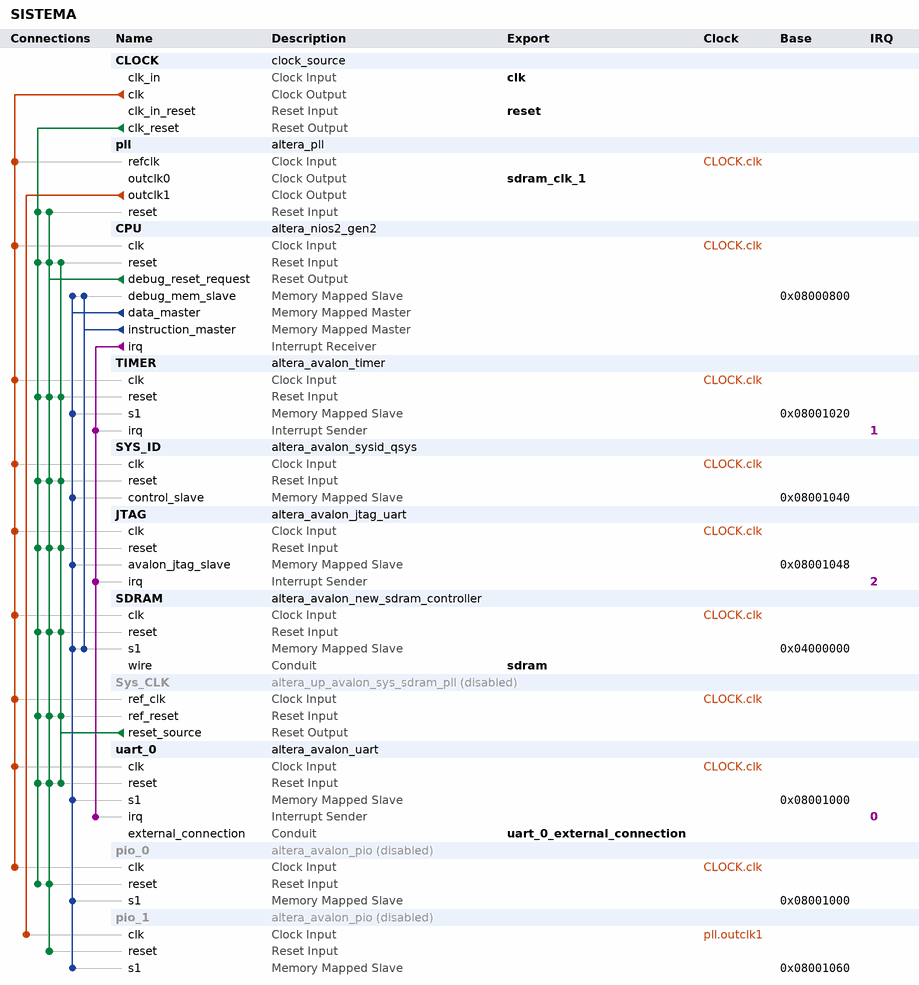
[diagram p0: system contents]
# Platform Designer (Qsys) system SISTEMA, Cyclone V 5CSXFC6D6F31C6
# Parameters at their usual value, and those the tool derives, are not listed.
package require -exact qsys 17.0
create_system SISTEMA
set_project_property DEVICE_FAMILY {Cyclone V}
set_project_property DEVICE 5CSXFC6D6F31C6

add_instance CLOCK clock_source 17.0
set_instance_parameter_value CLOCK clockFrequency 50000000

add_instance pll altera_pll 17.0
set_instance_parameter_value pll gui_device_speed_grade 1
set_instance_parameter_value pll gui_number_of_clocks 2
set_instance_parameter_value pll gui_operation_mode direct
set_instance_parameter_value pll gui_output_clock_frequency0 50.0
set_instance_parameter_value pll gui_output_clock_frequency1 50.0
set_instance_parameter_value pll gui_phase_shift0 -3800
set_instance_parameter_value pll gui_pll_mode {Integer-N PLL}
set_instance_parameter_value pll gui_reference_clock_frequency 50.0
set_instance_parameter_value pll gui_use_locked false

add_instance CPU altera_nios2_gen2 17.0
set_instance_parameter_value CPU dcache_size 2048
set_instance_parameter_value CPU exceptionSlave SDRAM.s1
set_instance_parameter_value CPU icache_size 4096
set_instance_parameter_value CPU impl Tiny
set_instance_parameter_value CPU resetSlave SDRAM.s1

add_instance TIMER altera_avalon_timer 17.0
set_instance_parameter_value TIMER period 1
set_instance_parameter_value TIMER periodUnits MSEC

add_instance SYS_ID altera_avalon_sysid_qsys 17.0
set_instance_parameter_value SYS_ID id 0

add_instance JTAG altera_avalon_jtag_uart 17.0
set_instance_parameter_value JTAG simInteractiveOptions NO_INTERACTIVE_WINDOWS

add_instance SDRAM altera_avalon_new_sdram_controller 17.0
set_instance_parameter_value SDRAM TAC 5.5
set_instance_parameter_value SDRAM TRCD 20.0
set_instance_parameter_value SDRAM TRP 20.0
set_instance_parameter_value SDRAM casLatency 3
set_instance_parameter_value SDRAM columnWidth 10
set_instance_parameter_value SDRAM dataWidth 16
set_instance_parameter_value SDRAM generateSimulationModel false
set_instance_parameter_value SDRAM model single_Micron_MT48LC4M32B2_7_chip
set_instance_parameter_value SDRAM numberOfBanks 4
set_instance_parameter_value SDRAM numberOfChipSelects 1
set_instance_parameter_value SDRAM powerUpDelay 200.0
set_instance_parameter_value SDRAM refreshPeriod 7.8125
set_instance_parameter_value SDRAM rowWidth 13

add_instance Sys_CLK altera_up_avalon_sys_sdram_pll 17.0
set_instance_property Sys_CLK ENABLED false
set_instance_parameter_value Sys_CLK CV_boards DE10-Standard
set_instance_parameter_value Sys_CLK gui_outclk 50.0
set_instance_parameter_value Sys_CLK gui_refclk 50.0

add_instance uart_0 altera_avalon_uart 17.0
set_instance_parameter_value uart_0 baud 115200
set_instance_parameter_value uart_0 dataBits 8
set_instance_parameter_value uart_0 fixedBaud true
set_instance_parameter_value uart_0 parity NONE
set_instance_parameter_value uart_0 stopBits 1

add_instance pio_0 altera_avalon_pio 17.0
set_instance_property pio_0 ENABLED false
set_instance_parameter_value pio_0 bitModifyingOutReg true
set_instance_parameter_value pio_0 direction Output
set_instance_parameter_value pio_0 width 7

add_instance pio_1 altera_avalon_pio 17.0
set_instance_property pio_1 ENABLED false
set_instance_parameter_value pio_1 direction Output
set_instance_parameter_value pio_1 width 14

# connections
add_connection CLOCK.clk CPU.clk clock
add_connection CLOCK.clk JTAG.clk clock
add_connection CLOCK.clk pio_0.clk clock
add_connection CLOCK.clk pll.refclk clock
add_connection CLOCK.clk SDRAM.clk clock
add_connection CLOCK.clk Sys_CLK.ref_clk clock
add_connection CLOCK.clk SYS_ID.clk clock
add_connection CLOCK.clk TIMER.clk clock
add_connection CLOCK.clk uart_0.clk clock
add_connection pll.outclk1 pio_1.clk clock
add_connection CLOCK.clk_reset CPU.reset reset
add_connection CLOCK.clk_reset JTAG.reset reset
add_connection CLOCK.clk_reset pio_0.reset reset
add_connection CLOCK.clk_reset pll.reset reset
add_connection CLOCK.clk_reset SDRAM.reset reset
add_connection CLOCK.clk_reset Sys_CLK.ref_reset reset
add_connection CLOCK.clk_reset SYS_ID.reset reset
add_connection CLOCK.clk_reset TIMER.reset reset
add_connection CLOCK.clk_reset uart_0.reset reset
add_connection CPU.debug_reset_request CPU.reset reset
add_connection CPU.debug_reset_request JTAG.reset reset
add_connection CPU.debug_reset_request pio_0.reset reset
add_connection CPU.debug_reset_request pio_1.reset reset
add_connection CPU.debug_reset_request pll.reset reset
add_connection CPU.debug_reset_request SDRAM.reset reset
add_connection CPU.debug_reset_request Sys_CLK.ref_reset reset
add_connection CPU.debug_reset_request SYS_ID.reset reset
add_connection CPU.debug_reset_request TIMER.reset reset
add_connection CPU.debug_reset_request uart_0.reset reset
add_connection Sys_CLK.reset_source CPU.reset reset
add_connection Sys_CLK.reset_source JTAG.reset reset
add_connection Sys_CLK.reset_source SDRAM.reset reset
add_connection Sys_CLK.reset_source Sys_CLK.ref_reset reset
add_connection Sys_CLK.reset_source SYS_ID.reset reset
add_connection Sys_CLK.reset_source TIMER.reset reset
add_connection Sys_CLK.reset_source uart_0.reset reset
add_connection CPU.data_master CPU.debug_mem_slave avalon
set_connection_parameter_value CPU.data_master/CPU.debug_mem_slave baseAddress 0x08000800
add_connection CPU.data_master JTAG.avalon_jtag_slave avalon
set_connection_parameter_value CPU.data_master/JTAG.avalon_jtag_slave baseAddress 0x08001048
add_connection CPU.data_master pio_0.s1 avalon
set_connection_parameter_value CPU.data_master/pio_0.s1 baseAddress 0x08001000
add_connection CPU.data_master pio_1.s1 avalon
set_connection_parameter_value CPU.data_master/pio_1.s1 baseAddress 0x08001060
add_connection CPU.data_master SDRAM.s1 avalon
set_connection_parameter_value CPU.data_master/SDRAM.s1 baseAddress 0x04000000
add_connection CPU.data_master SYS_ID.control_slave avalon
set_connection_parameter_value CPU.data_master/SYS_ID.control_slave baseAddress 0x08001040
add_connection CPU.data_master TIMER.s1 avalon
set_connection_parameter_value CPU.data_master/TIMER.s1 baseAddress 0x08001020
add_connection CPU.data_master uart_0.s1 avalon
set_connection_parameter_value CPU.data_master/uart_0.s1 baseAddress 0x08001000
add_connection CPU.instruction_master CPU.debug_mem_slave avalon
set_connection_parameter_value CPU.instruction_master/CPU.debug_mem_slave baseAddress 0x08000800
add_connection CPU.instruction_master SDRAM.s1 avalon
set_connection_parameter_value CPU.instruction_master/SDRAM.s1 baseAddress 0x04000000
add_connection CPU.irq JTAG.irq interrupt
set_connection_parameter_value CPU.irq/JTAG.irq irqNumber 2
add_connection CPU.irq TIMER.irq interrupt
set_connection_parameter_value CPU.irq/TIMER.irq irqNumber 1
add_connection CPU.irq uart_0.irq interrupt
set_connection_parameter_value CPU.irq/uart_0.irq irqNumber 0

# exported interfaces
add_interface clk clock sink
set_interface_property clk EXPORT_OF CLOCK.clk_in
add_interface reset reset sink
set_interface_property reset EXPORT_OF CLOCK.clk_in_reset
add_interface sdram conduit end
set_interface_property sdram EXPORT_OF SDRAM.wire
add_interface sdram_clk_1 clock source
set_interface_property sdram_clk_1 EXPORT_OF pll.outclk0
add_interface uart_0_external_connection conduit end
set_interface_property uart_0_external_connection EXPORT_OF uart_0.external_connection

set_interconnect_requirement {$system} qsys_mm.clockCrossingAdapter HANDSHAKE
set_interconnect_requirement {$system} qsys_mm.enableEccProtection FALSE
set_interconnect_requirement {$system} qsys_mm.insertDefaultSlave FALSE
set_interconnect_requirement {$system} qsys_mm.maxAdditionalLatency 1

save_system SISTEMA.qsys
